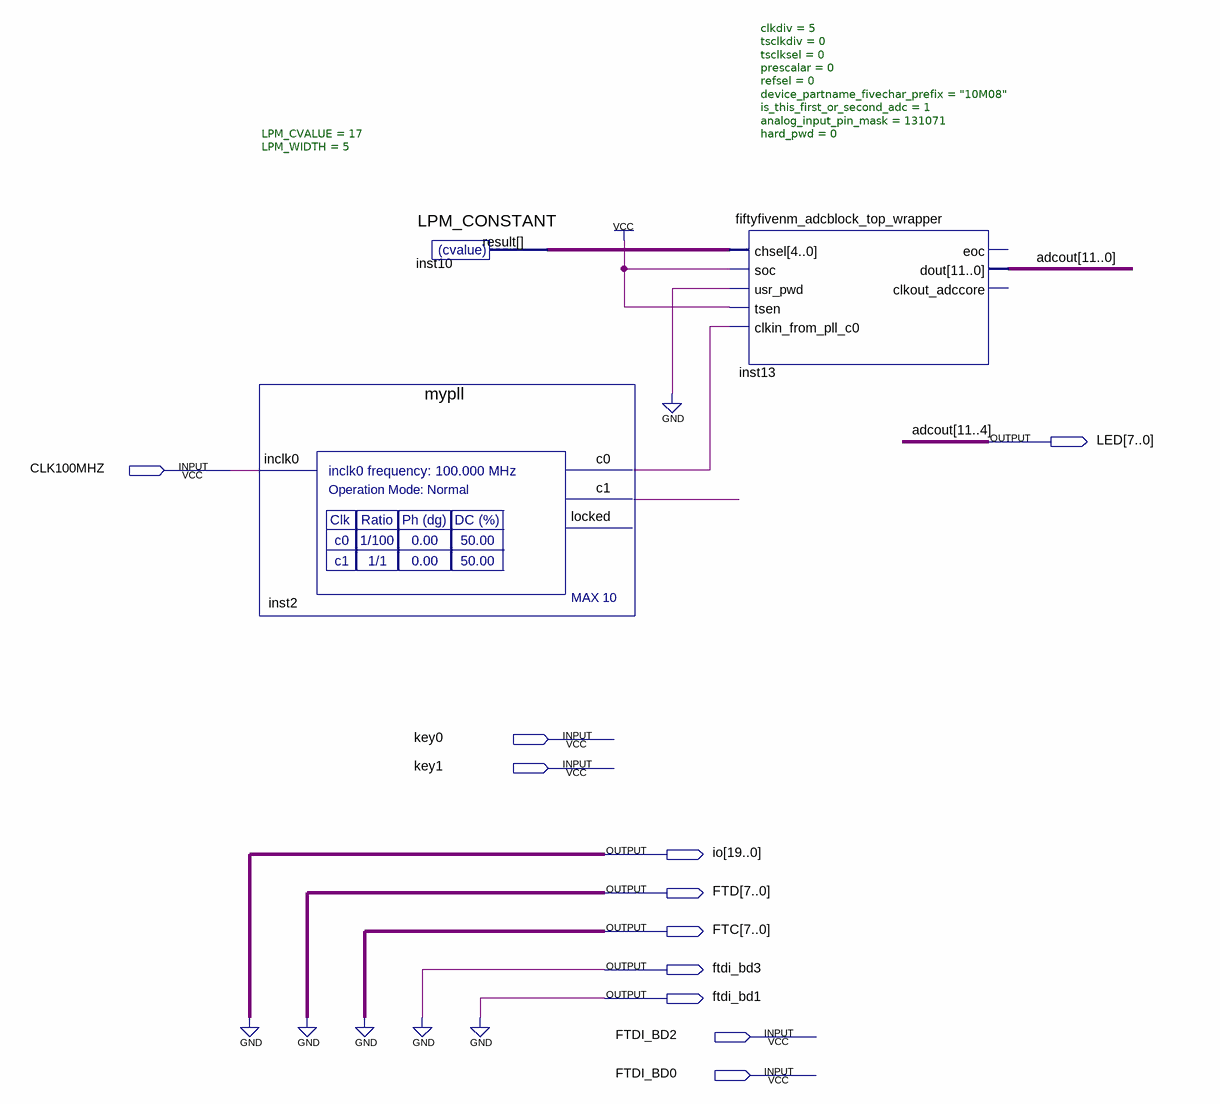
[diagram p0: schematic sheet]
// Quartus schematic max10.bdf as structural Verilog: 3 symbols, 11 pins
module max10 (
  input  CLK100MHZ,
  input  key0,
  input  key1,
  input  FTDI_BD2,
  input  FTDI_BD0,
  output [7:0] LED,
  output [19:0] io,
  output [7:0] FTD,
  output [7:0] FTC,
  output ftdi_bd3,
  output ftdi_bd1
);

  wire inst2_c0, inst2_c1;
  wire [3:0] adcout;
  wire [4:0] inst10_result;

  mypll inst2 (.inclk0(CLK100MHZ), .c0(inst2_c0), .c1(inst2_c1));  // open: locked
  LPM_CONSTANT #(.LPM_CVALUE(17), .LPM_WIDTH(5)) inst10 (.result(inst10_result));
  fiftyfivenm_adcblock_top_wrapper #(.clkdiv(5), .tsclkdiv(0), .tsclksel(0), .prescalar(0), .refsel(0), .device_partname_fivechar_prefix("10M08"), .is_this_first_or_second_adc(1), .analog_input_pin_mask(131071), .hard_pwd(0)) inst13 (
    .chsel(inst10_result), .soc(1'b1), .usr_pwd(1'b0), .tsen(1'b1), .clkin_from_pll_c0(inst2_c0),
    .dout({LED, adcout}));  // open: eoc, clkout_adccore

  assign FTC = {8{1'b0}};
  assign FTD = {8{1'b0}};
  assign ftdi_bd1 = 1'b0;
  assign ftdi_bd3 = 1'b0;
  assign io = {20{1'b0}};

  // Other names for the same wires on the sheet: adcout[11:4] = LED
endmodule
